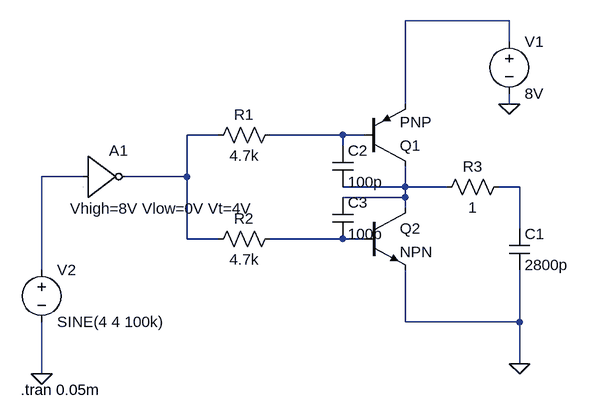
[diagram p0: schematic Draft2.asc]
Draft2.asc, the LTspice schematic file:
Version 4
SHEET 1 880 680
WIRE 656 -224 496 -224
WIRE 656 -192 656 -224
WIRE 496 -96 496 -224
WIRE 656 -96 656 -112
WIRE 208 -48 160 -48
WIRE 400 -48 288 -48
WIRE 432 -48 400 -48
WIRE 400 -32 400 -48
WIRE 0 16 -64 16
WIRE 160 16 160 -48
WIRE 160 16 64 16
WIRE 496 32 496 0
WIRE 496 32 400 32
WIRE 560 32 496 32
WIRE 672 32 640 32
WIRE 496 48 496 32
WIRE 496 48 400 48
WIRE 496 64 496 48
WIRE 672 96 672 32
WIRE 160 112 160 16
WIRE 208 112 160 112
WIRE 400 112 288 112
WIRE 432 112 400 112
WIRE -64 160 -64 16
WIRE 496 240 496 160
WIRE 672 240 672 160
WIRE 672 240 496 240
WIRE 672 304 672 240
WIRE -64 320 -64 240
FLAG -64 320 0
FLAG 672 304 0
FLAG 656 -96 0
SYMBOL pnp 432 0 M180
SYMATTR InstName Q1
SYMBOL npn 432 64 R0
SYMATTR InstName Q2
SYMBOL voltage 656 -208 R0
WINDOW 123 0 0 Left 2
WINDOW 39 0 0 Left 2
SYMATTR InstName V1
SYMATTR Value 8V
SYMBOL cap 656 96 R0
SYMATTR InstName C1
SYMATTR Value 2800p
SYMBOL voltage -64 144 R0
WINDOW 123 0 0 Left 2
WINDOW 39 0 0 Left 2
SYMATTR InstName V2
SYMATTR Value SINE(4 4 100k)
SYMBOL Digital\\inv 0 -48 R0
WINDOW 39 -20 113 Left 2
SYMATTR SpiceLine Vhigh=8V Vlow=0V Vt=4V
SYMATTR InstName A1
SYMBOL res 304 -64 R90
WINDOW 0 0 56 VBottom 2
WINDOW 3 32 56 VTop 2
SYMATTR InstName R1
SYMATTR Value 4.7k
SYMBOL res 304 96 R90
WINDOW 0 0 56 VBottom 2
WINDOW 3 32 56 VTop 2
SYMATTR InstName R2
SYMATTR Value 4.7k
SYMBOL res 656 16 R90
WINDOW 0 0 56 VBottom 2
WINDOW 3 32 56 VTop 2
SYMATTR InstName R3
SYMATTR Value 1
SYMBOL cap 384 -32 R0
SYMATTR InstName C2
SYMATTR Value 100p
SYMBOL cap 384 48 R0
SYMATTR InstName C3
SYMATTR Value 100p
TEXT -96 344 Left 2 !.tran 0.05m

The netlist it stands for:
* Draft2.asc
Q1 N005 N003 N001 0 PNP
Q2 N005 N007 0 0 NPN
V1 N001 0 8V
C1 N006 0 2800p
V2 N004 0 SINE(4 4 100k)
A1 N004 0 0 0 0 N002 0 0 BUF Vhigh=8V Vlow=0V Vt=4V
R1 N003 N002 4.7k
R2 N007 N002 4.7k
R3 N006 N005 1
C2 N003 N005 100p
C3 N005 N007 100p
.model NPN NPN
.model PNP PNP
.lib standard.bjt
.tran 0.05m
.backanno
.end